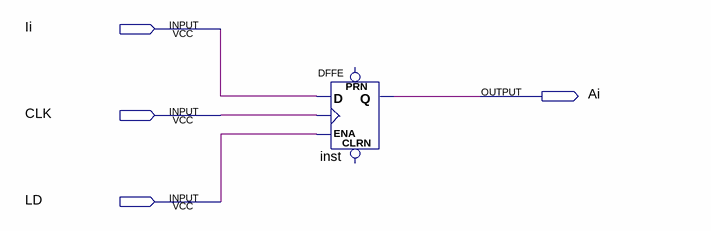
[diagram p0: schematic sheet]
// Quartus schematic REG1_LD.bdf as structural Verilog: 1 symbols, 4 pins
module REG1_LD (
  input  Ii,
  input  CLK,
  input  LD,
  output Ai
);

  DFFE inst (.D(Ii), .CLK(CLK), .ENA(LD), .Q(Ai));  // open: PRN, CLRN
endmodule
